# Altium schematic sheet Microprocessor Module_1.SchDoc
size A; SheetNumber: 1; SheetTotal: 4
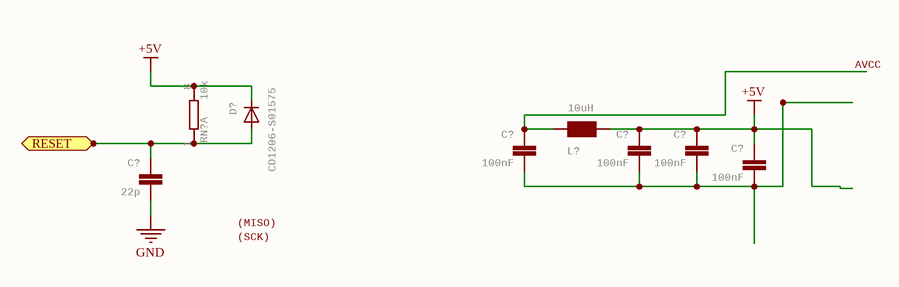
[diagram p0: Microprocessor Module_1.SchDoc]

## Parts
(Parts that share a designator on the sheet are numbered #1, #2 ... from top to bottom, then left to right.)
C?#1  100nF  [C0603-ROUND]
C?#2  100nF  [C0603-ROUND]
C?#3  100nF  [C0603-ROUND]
C?#4  100nF  [C0603-ROUND]
C?#5  22p  [C0603-ROUND]
D?  CD1206-S01575  [MINIMELF]
L?  10uH  [0805]
RN?  10k  [CAY16]  (part A of 4)

## Ports
RESET (bidir)

## Nets
+5V: C?#2.1 C?#3.1 C?#4.1 D?.C L?.2 RN?.8
GND: C?#5.2
AVCC: C?#1.1 L?.1
RESET: C?#5.1 D?.A RN?.1 ; port RESET
NetC?#1_2: C?#1.2 C?#2.2 C?#3.2 C?#4.2

## Notes on the sheet
- (MISO)
- (SCK)

## Library data of the parts
C?#1-C?#4 = 0015_100NF_0603: 100nF 0603 50V; PART_NUMBER: cl10b104kbnc; GateName_1: G$1; SymbolName_1: C-EU; MONTHLY_USAGE: _____; TYPE: Condensatori; LibraryName: Condensatori; DeviceSetName: 0015_100NF_0603; CASE: 0603; PRICE: _____; SUPPLIER: _____
C?#5 = 0014_22PF_0603: 22pF 0603; GateName_1: G$1; SymbolName_1: C-EU; MONTHLY_USAGE: _____; TYPE: Condensatori; LibraryName: Condensatori; DeviceSetName: 0014_22PF_0603; CASE: 0603; PART_NUMBER: 22pF_0603; PRICE: _____; SUPPLIER: _____
D? = 0012_CD1206-S01575: small-signal high-speed Switching Diodes   CD1206; GateName_1: G$1; SymbolName_1: D; MONTHLY_USAGE: _____; TYPE: Diodi; LibraryName: Diodi; DeviceSetName: 0012_CD1206-S01575; CASE: 1206; PART_NUMBER: CD1206-S01575; PRICE: _____; SUPPLIER: _____
L? = 0715_CV201210-100K: 10uH 0805; GateName_1: G$1; SymbolName_1: L; MONTHLY_USAGE: _____; TYPE: Induttanze; LibraryName: Induttanze; DeviceSetName: 0715_CV201210-100K; CASE: 0805; PART_NUMBER: CV201210-100K; PRICE: _____; SUPPLIER: _____
RN? = 0016_064R_10K_/_CAY16-103J4LF: 10K 064 R; GateName_1: A; SymbolName_1: R1NV; GateName_2: B; GateName_3: C; GateName_4: D; MONTHLY_USAGE: _____; SymbolName_2: R1NV; SymbolName_3: R1NV; SymbolName_4: R1NV; LibraryName: Resistenze; DeviceSetName: 0016_064R_10K_/_CAY16-103J4LF; CASE: SMD_3,2x1,6; PART_NUMBER: 064R_10K_/_CAY16-103J4LF; PRICE: _____; SUPPLIER: _____; TYPE: Resistenze